# EAGLE design preamp (EAGLE 9.2.1)
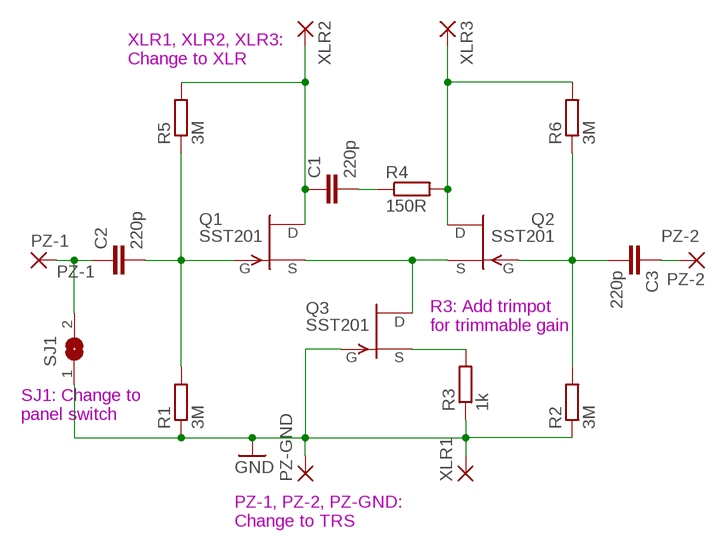
[diagram p0: schematic, sheet 1]

## Parts
C1  220p  C-EUC1206  [C1206]
C2  220p  C-EUC1206  [C1206]
C3  220p  C-EUC1206  [C1206]
PZ-1  3,17/1,3  [3,17/1,3]
PZ-2  3,17/1,3  [3,17/1,3]
PZ-GND  3,17/1,3  [3,17/1,3]
Q1  SST201  [SOT23]
Q2  SST201  [SOT23]
Q3  SST201  [SOT23]
R1  3M  R-EU_R1206  [R1206]
R2  3M  R-EU_R1206  [R1206]
R3  1k  R-EU_R1206  [R1206]
R4  150R  R-EU_R1206  [R1206]
R5  3M  R-EU_R1206  [R1206]
R6  3M  R-EU_R1206  [R1206]
SJ1  SJ  [SJ]
XLR1  3,17/1,3  [3,17/1,3]
XLR2  3,17/1,3  [3,17/1,3]
XLR3  3,17/1,3  [3,17/1,3]

## Nets
GND: PZ-GND.1(P) Q3.3(G) R1.1 R2.1 R3.1 SJ1.1 XLR1.1(P)
N$1: Q1.2(S) Q2.2(S) Q3.1(D)
N$3: C2.2 Q1.3(G) R1.2 R5.1
N$5: C1.2 R4.1
N$7: C3.2 Q2.3(G) R2.2 R6.1
N$9: Q3.2(S) R3.2
PZ-1: C2.1 PZ-1.1(P) SJ1.2
PZ-2: C3.1 PZ-2.1(P)
XLR3: Q2.1(D) R4.2 R6.2 XLR3.1(P)
XLR-2: C1.1 Q1.1(D) R5.2 XLR2.1(P)

## Notes on the sheet
- XLR1, XLR2, XLR3:
  Change to XLR
- R3: Add trimpot 
  for trimmable gain
- SJ1: Change to
  panel switch
- PZ-1, PZ-2, PZ-GND:
  Change to TRS

## Library data of the parts
C1-C3 = rcl:C-EU: CAPACITOR, European symbol
PZ-1 PZ-2 PZ-GND XLR1-XLR3 = wirepad:3,17/1,3: THROUGH-HOLE PAD
Q1-Q3 = transistor-fet:?20*: TEMIC / Siliconix N-Channel JFET Source: JFET-J201_Siliconix_data.pdf
R1-R6 = rcl:R-EU_: RESISTOR, European symbol
SJ1 = jumper:SJ: SMD solder JUMPER

## Board
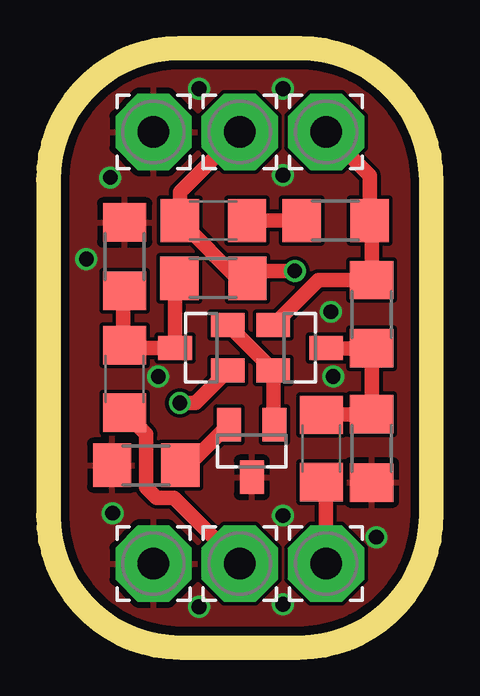
[diagram p1: board, top side]
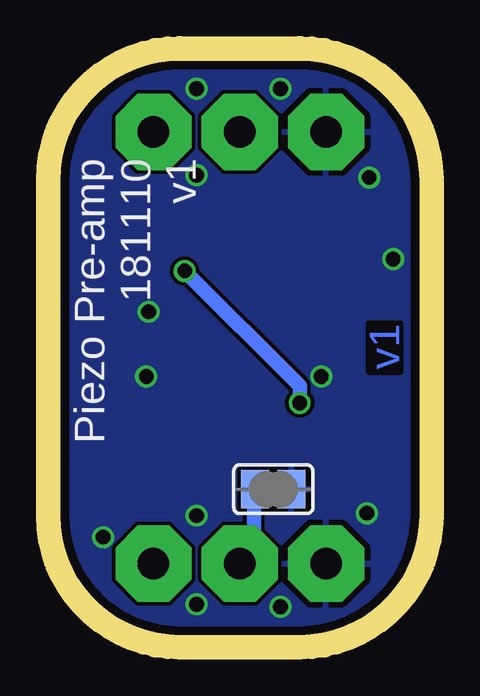
[diagram p2: board, bottom side, seen from below]

Size 15 x 24 mm. Coordinates in mm from the lower left corner, seen from the top.
Outline: 5,0 10,0 arc90 15,5 15,19 arc90 10,24 5,24 arc90 0,19 0,5 arc90 5,0
Copper layers (1*16): Top 0.035559375mm / dielectric 1.6mm / Bottom 0.035559375mm
Design rules "oshpark-2layer *": minimum track width 6mil, minimum drill 10mil, track to track 6mil, track to pad 6mil, pad to pad 6mil, via to via 6mil, smd to smd 6mil, copper to edge 15mil, drill to drill 6mil, minimum pad ring 5mil, minimum via ring 5mil, stop-mask expansion 2.5mil, vias tented up to drill 24mil, thermal gap 10mil
Milling: 8 lines

### Footprints (pad centres in the part's own frame; a part is rotated, then mirrored left to right if it is on the bottom)
C1206 = smd 1.6 x 1.8: 1 -1.4,0; 2 1.4,0
3,17/1,3 = drill 1.321 pad 3.175 octagon: 1 0,0
SOT23 = smd 1 x 1.4: 1 -0.95,-1.1; 2 0.95,-1.1; 3 0,1.1
R1206 = smd 1.6 x 1.803: 1 -1.422,0; 2 1.422,0
SJ = smd 1.168 x 1.6: 1 -0.762,0; 2 0.762,0

### Placement (x,y rotation side)
C1  6.4,17.3 0 top
C2  2.7,10.7 90 top
C3  10.9,7.8 90 top
PZ-1  7.5,3 0 top
PZ-2  11.1,3 0 top
PZ-GND  3.9,3 0 top
Q1  5.9,12 90 top
Q2  10,12 270 top
Q3  8,7.7 180 top
R1  2.7,15.8 270 top
R2  13,7.8 90 top
R3  3.6,7.1 0 top
R4  11.5,17.3 0 top
R5  6.4,14.9 0 top
R6  13,13.4 90 top
SJ1  6.1,6.1 180 bottom
XLR1  3.9,21 0 top
XLR2  7.5,21 0 top
XLR3  11.1,21 0 top

### Tracks (layer width: path | path; a pad name or v marks a point on that pad's centre or on a via)
GND  (via drill 0.61)
  other vias: 9.3,5 13.2,4.1 9.3,19.2 11.3,13.5 5.8,1.2 9.3,1.3 5.8,22.8 9.3,22.8 2.1,19.1 1.1,15.7 4.1,10.8 11.4,10.8 2.2,5.1
  pour Top: 0,5 0,19 arc-90 5,24 10,24 arc-90 15,19 15,5 arc-90 10,0 5,0 arc-90
  pour Bottom: 0,5 0,19 arc-90 5,24 10,24 arc-90 15,19 15,5 arc-90 10,0 5,0 arc-90
N$1
  Top 0.607: Q1.2 Q2.2 8.9,8.85 Q3.1
N$3
  Top 0.607: R5.1 4.77,14.68 4.8,14.65 Q1.3 2.8,12 C2.2 2.64,12.18 2.64,14.32 arc90 R1.2
N$5
  Top 0.607: R4.1 C1.2
N$7
  Top 0.607: C3.2 10.9,9.22 R2.2 R6.1 11.12,11.98 Q2.3
N$9
  Top 0.607: Q3.2 5.35,7.1 R3.2
PZ-1
  Top 0.607: C2.1 3.6,8.4 3.6,6.18 4.03,5.74 4.76,5.74 PZ-1.1
  Bottom 0.607: SJ1.2 6.9,6.06 6.9,3.6 PZ-1.1
PZ-2
  Top 0.607: PZ-2.1 11.1,6.2 C3.1
XLR3
  Top 0.607: XLR3.1 12.92,19.18 R4.2 13,17.22 R6.2 10.77,14.82 Q2.1
XLR-2  (via drill 0.61)
  Top 0.607: v9.8,15.2 8.13,15.2 R5.2 7.54,14.76 C1.1 5,18.5 XLR2.1 | Q1.1 5.65,9.7 v5,9.7
  Bottom 0.607: v5,9.7 5,10.4 v9.8,15.2

### Text on the board
Bottom: v1
bPlace: Piezo Pre-amp / 181110 / v1